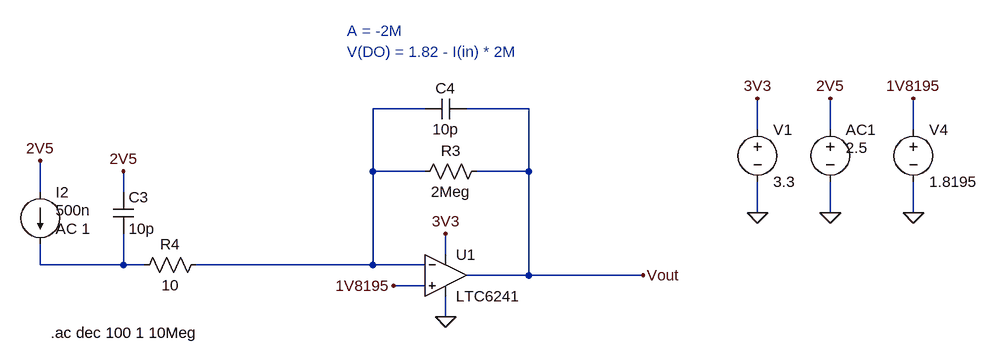
[diagram p0: schematic Draft3.asc]
Draft3.asc, the LTspice schematic file:
Version 4
SHEET 1 2600 680
WIRE 1264 16 1184 16
WIRE 1424 16 1328 16
WIRE 1776 48 1776 0
WIRE 1888 48 1888 0
WIRE 2016 48 2016 0
WIRE 1184 112 1184 16
WIRE 1264 112 1184 112
WIRE 1424 112 1424 16
WIRE 1424 112 1344 112
WIRE 672 144 672 96
WIRE 800 144 800 112
WIRE 1776 176 1776 128
WIRE 1888 176 1888 128
WIRE 2016 176 2016 128
WIRE 1296 240 1296 208
WIRE 672 256 672 224
WIRE 800 256 800 208
WIRE 800 256 672 256
WIRE 832 256 800 256
WIRE 1184 256 1184 112
WIRE 1184 256 912 256
WIRE 1264 256 1184 256
WIRE 1424 272 1424 112
WIRE 1424 272 1328 272
WIRE 1600 272 1424 272
WIRE 1264 288 1216 288
WIRE 1296 336 1296 304
FLAG 1296 336 0
FLAG 1296 208 3V3
FLAG 2016 0 1V8195
FLAG 2016 176 0
FLAG 1600 272 Vout
FLAG 1216 288 1V8195
FLAG 1888 0 2V5
FLAG 1888 176 0
FLAG 672 96 2V5
FLAG 800 112 2V5
FLAG 1776 0 3V3
FLAG 1776 176 0
SYMBOL res 1360 96 R90
WINDOW 0 0 56 VBottom 2
WINDOW 3 32 56 VTop 2
SYMATTR InstName R3
SYMATTR Value 2Meg
SYMATTR SpiceLine tol=0.1 pwr=0.25
SYMBOL res 928 240 R90
WINDOW 0 0 56 VBottom 2
WINDOW 3 32 56 VTop 2
SYMATTR InstName R4
SYMATTR Value 10
SYMBOL voltage 2016 32 R0
WINDOW 123 0 0 Left 0
WINDOW 39 0 0 Left 0
SYMATTR InstName V4
SYMATTR Value 1.8195
SYMBOL OpAmps\\LTC6241 1296 272 R0
SYMATTR InstName U1
SYMBOL voltage 1888 32 R0
WINDOW 123 24 44 Left 2
WINDOW 39 0 0 Left 0
WINDOW 3 24 44 Left 2
SYMATTR InstName AC1
SYMATTR Value 2.5
SYMBOL current 672 144 R0
WINDOW 3 24 28 Left 2
WINDOW 123 24 56 Left 2
WINDOW 39 0 0 Left 0
SYMATTR Value 500n
SYMATTR Value2 AC 1
SYMATTR InstName I2
SYMBOL cap 784 144 R0
SYMATTR InstName C3
SYMATTR Value 10p
SYMATTR SpiceLine V=10
SYMBOL cap 1328 0 R90
WINDOW 0 0 32 VBottom 2
WINDOW 3 32 32 VTop 2
SYMATTR InstName C4
SYMATTR Value 10p
SYMBOL voltage 1776 32 R0
WINDOW 123 0 0 Left 0
WINDOW 39 0 0 Left 0
SYMATTR InstName V1
SYMATTR Value 3.3
TEXT 1144 -104 Left 2 ;A = -2M
TEXT 1144 -72 Left 2 ;V(DO) = 1.82 - I(in) * 2M
TEXT 688 360 Left 2 !.ac dec 100 1 10Meg

The netlist it stands for:
* Draft3.asc
R3 Vout N001 2Meg tol=0.1 pwr=0.25
R4 N001 N002 10
V4 1V8195 0 1.8195
XU1 1V8195 N001 3V3 0 Vout LTC6241  ; pins In+ In- V+ V- OUT
V§AC1 2V5 0 2.5
I2 2V5 N002 500n AC 1
C3 2V5 N002 10p V=10
C4 Vout N001 10p
V1 3V3 0 3.3
* A = -2M
* V(DO) = 1.82 - I(in) * 2M
.ac dec 100 1 10Meg
.lib LTC4.lib
.backanno
.end